# Altium schematic sheet 2226051_이강민_ATmega128_Sheet.SchDoc
size A4; SheetNumber: 1; SheetTotal: 1; SPICEModelCacheOTDOZMBM: <root> / <DocumentId>OTDOZMBM</DocumentId> / </root>
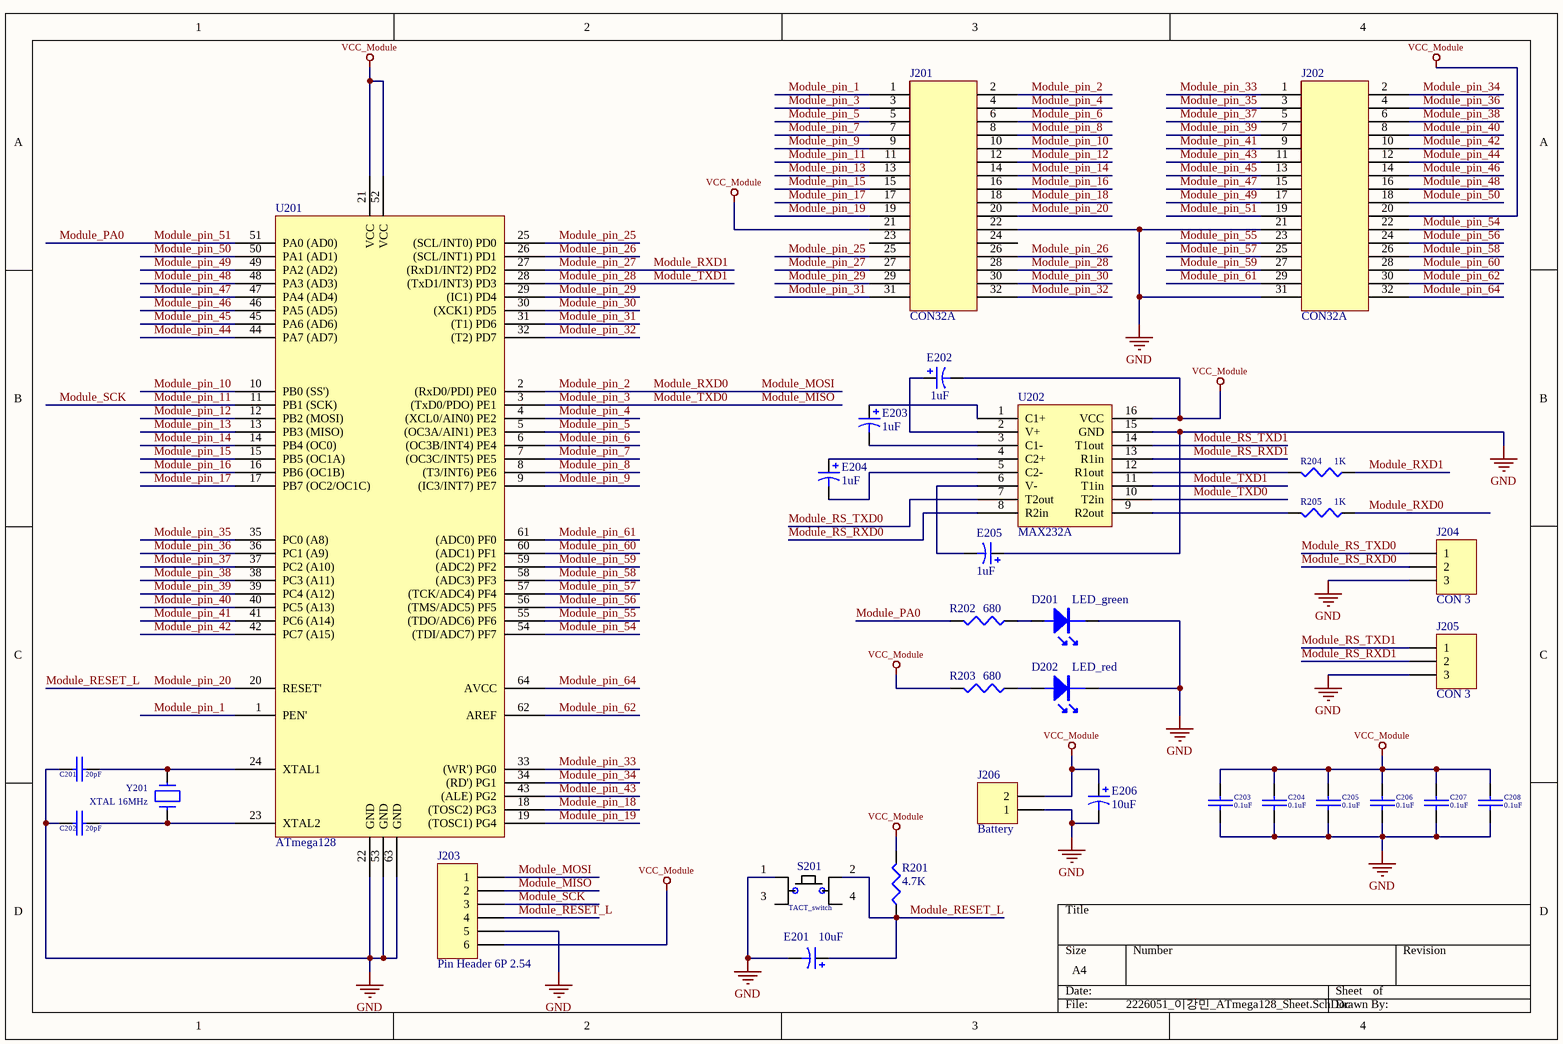
[diagram p0: 2226051_이강민_ATmega128_Sheet.SchDoc]

## Parts
C201  20pF  [0603C1608]
C202  20pF  [0603C1608]
C203  0.1uF  [0603C1608]
C204  0.1uF  [0603C1608]
C205  0.1uF  [0603C1608]
C206  0.1uF  [0603C1608]
C207  0.1uF  [0603C1608]
C208  0.1uF  [0603C1608]
D201  LED_green  [LED-2012]
D202  LED_red  [LED-2012]
E201  value 10uF  [C0805]  (hidden comment: Cap Pol3)
E202  value 1uF  [C0805]  (hidden comment: Cap Pol3)
E203  value 1uF  [C0805]  (hidden comment: Cap Pol3)
E204  value 1uF  [C0805]  (hidden comment: Cap Pol3)
E205  value 1uF  [C0805]  (hidden comment: Cap Pol3)
E206  value 10uF  [C0805]  (hidden comment: Cap Pol3)
J201  CON32A  [CON32A]
J202  CON32A  [CON32A]
J203  Pin Header 6P 2.54  [ISP_connector]
J204  CON 3  [RS-232_connector]
J205  CON 3  [RS-232_connector]
J206  Battery  [battery_2pin]
R201  value 4.7K  [J1-0603]  (hidden comment: Res3)
R202  value 680  [J1-0603]  (hidden comment: Res3)
R203  value 680  [J1-0603]  (hidden comment: Res3)
R204  value 1K  [J1-0603]  (hidden comment: Res3)
R205  value 1K  [J1-0603]  (hidden comment: Res3)
S201  TACT_switch  [IT-1109S]
U201  ATmega128  [ATmega128_1414]
U202  MAX232A  [MAX232A]
Y201  XTAL 16MHz  [X-TAL_SMD]

## Nets
GND: C201.1 C202.1 C203.1 C204.1 C205.1 C206.1 C207.1 C208.1 D201.2(K) D202.2(K) E201.2 E205.1 E206.2 J201.22 J202.21 J202.31 J203.5 J204.3 J205.3 J206.1 S201.1 U201.22(GND) U201.53(GND) U201.63(GND) U202.15(GND)
VCC_Module: C203.2 C204.2 C205.2 C206.2 C207.2 C208.2 E202.2 E206.1 J201.21 J202.20 J203.6 J206.2 R201.2 R203.2 U201.21(VCC) U201.52(VCC) U202.16(VCC)
Module_MISO: J201.3 J203.2 U201.3((TxD0/PDO)_PE1) U202.10(T2in)  [also labelled Module_pin_3, Module_TXD0]
Module_MOSI: J201.2 J203.1 R205.1 U201.2((RxD0/PDI)_PE0)  [also labelled Module_pin_2, Module_RXD0]
Module_PA0: J202.19 R202.2 U201.51(PA0_(AD0))  [also labelled Module_pin_51]
Module_pin_1: J201.1 U201.1(PEN')
Module_pin_4: J201.4 U201.4((XCL0/AIN0)_PE2)
Module_pin_5: J201.5 U201.5((OC3A/AIN1)_PE3)
Module_pin_6: J201.6 U201.6((OC3B/INT4)_PE4)
Module_pin_7: J201.7 U201.7((OC3C/INT5)_PE5)
Module_pin_8: J201.8 U201.8((T3/INT6)_PE6)
Module_pin_9: J201.9 U201.9((IC3/INT7)_PE7)
Module_pin_10: J201.10 U201.10(PB0_(SS'))
Module_pin_11: J201.11 J203.3 U201.11(PB1_(SCK))  [also labelled Module_SCK]
Module_pin_12: J201.12 U201.12(PB2_(MOSI))
Module_pin_13: J201.13 U201.13(PB3_(MISO))
Module_pin_14: J201.14 U201.14(PB4_(OC0))
Module_pin_15: J201.15 U201.15(PB5_(OC1A))
Module_pin_16: J201.16 U201.16(PB6_(OC1B))
Module_pin_17: J201.17 U201.17(PB7_(OC2/OC1C))
Module_pin_18: J201.18 U201.18((TOSC2)_PG3)
Module_pin_19: J201.19 U201.19((TOSC1)_PG4)
Module_pin_20: E201.1 J201.20 J203.4 R201.1 S201.2 U201.20(RESET')  [also labelled Module_RESET_L]
Module_pin_25: J201.25 U201.25((SCL/INT0)_PD0)
Module_pin_26: J201.26 U201.26((SCL/INT1)_PD1)
Module_pin_27: J201.27 R204.1 U201.27((RxD1/INT2)_PD2)  [also labelled Module_RXD1]
Module_pin_28: J201.28 U201.28((TxD1/INT3)_PD3) U202.11(T1in)  [also labelled Module_TXD1]
Module_pin_29: J201.29 U201.29((IC1)_PD4)
Module_pin_30: J201.30 U201.30((XCK1)_PD5)
Module_pin_31: J201.31 U201.31((T1)_PD6)
Module_pin_32: J201.32 U201.32((T2)_PD7)
Module_pin_33: J202.1 U201.33((WR')_PG0)
Module_pin_34: J202.2 U201.34((RD')_PG1)
Module_pin_35: J202.3 U201.35(PC0_(A8))
Module_pin_36: J202.4 U201.36(PC1_(A9))
Module_pin_37: J202.5 U201.37(PC2_(A10))
Module_pin_38: J202.6 U201.38(PC3_(A11))
Module_pin_39: J202.7 U201.39(PC4_(A12))
Module_pin_40: J202.8 U201.40(PC5_(A13))
Module_pin_41: J202.9 U201.41(PC6_(A14))
Module_pin_42: J202.10 U201.42(PC7_(A15))
Module_pin_43: J202.11 U201.43((ALE)_PG2)
Module_pin_44: J202.12 U201.44(PA7_(AD7))
Module_pin_45: J202.13 U201.45(PA6_(AD6))
Module_pin_46: J202.14 U201.46(PA5_(AD5))
Module_pin_47: J202.15 U201.47(PA4_(AD4))
Module_pin_48: J202.16 U201.48(PA3_(AD3))
Module_pin_49: J202.17 U201.49(PA2_(AD2))
Module_pin_50: J202.18 U201.50(PA1_(AD1))
Module_pin_54: J202.22 U201.54((TDI/ADC7)_PF7)
Module_pin_55: J202.23 U201.55((TDO/ADC6)_PF6)
Module_pin_56: J202.24 U201.56((TMS/ADC5)_PF5)
Module_pin_57: J202.25 U201.57((TCK/ADC4)_PF4)
Module_pin_58: J202.26 U201.58((ADC3)_PF3)
Module_pin_59: J202.27 U201.59((ADC2)_PF2)
Module_pin_60: J202.28 U201.60((ADC1)_PF1)
Module_pin_61: J202.29 U201.61((ADC0)_PF0)
Module_pin_62: J202.30 U201.62(AREF)
Module_pin_64: J202.32 U201.64(AVCC)
Module_RS_RXD0: J204.2 U202.8(R2in)
Module_RS_RXD1: J205.2 U202.13(R1in)
Module_RS_TXD0: J204.1 U202.7(T2out)
Module_RS_TXD1: J205.1 U202.14(T1out)
NetC201_2: C201.2 U201.24(XTAL1) Y201.2
NetC202_2: C202.2 U201.23(XTAL2) Y201.1
NetD201_1: D201.1(A) R202.1
NetD202_1: D202.1(A) R203.1
NetE202_1: E202.1 U202.2(V+)
NetE203_1: E203.1 U202.1(C1+)
NetE203_2: E203.2 U202.3(C1-)
NetE204_1: E204.1 U202.4(C2+)
NetE204_2: E204.2 U202.5(C2-)
NetE205_2: E205.2 U202.6(V-)
NetR204_2: R204.2 U202.12(R1out)
NetR205_2: R205.2 U202.9(R2out)

Not connected (* = marked no-connect by the designer): J201 23 24; S201 3 4

## Library data of the parts
C201-C208 = CAP-Chip: SMDCapacitor
D201 D202 = LED
E201-E206 = Cap Pol3: Polarized Capacitor (Surface Mount); Published: 8-Jun-2000; LatestRevisionDate: 29-May-2009; LatestRevisionNote: IPC-7351 Footprint Added.; PackageReference: C0805; Publisher: Altium Limited; PackageDescription: Chip Capacitor
J203 = Header 6: Header, 6-Pin; LatestRevisionDate: 17-Jul-2002; LatestRevisionNote: Re-released for DXP Platform.; Publisher: Altium Limited
J204 J205 = Header 3: Header, 3-Pin; LatestRevisionDate: 17-Jul-2002; LatestRevisionNote: Re-released for DXP Platform.; Publisher: Altium Limited
J206 = Header 2: Header, 2-Pin; LatestRevisionDate: 17-Jul-2002; LatestRevisionNote: Re-released for DXP Platform.; Publisher: Altium Limited
R201-R205 = Res3: Resistor; Published: 8-Jun-2000; LatestRevisionDate: 29-May-2009; LatestRevisionNote: IPC-7351 Footprint Added.; PackageReference: J1-0603; Publisher: Altium Limited; PackageDescription: Chip Resistor
Y201 = CRYSTAL